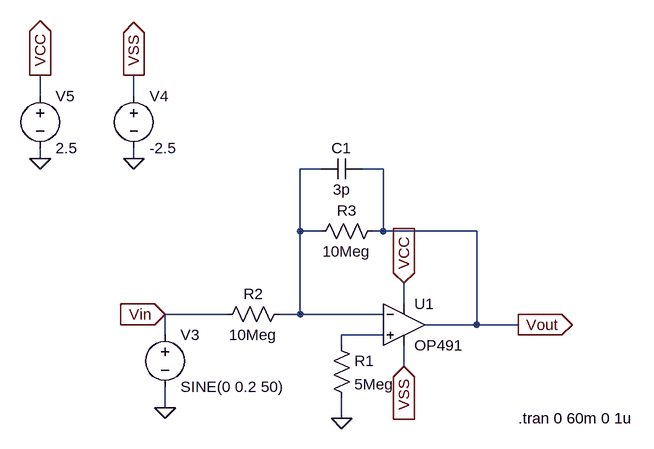
[diagram p0: schematic 007-Inverting-Amplifier-With-High-Input-Impedance.asc]
007-Inverting-Amplifier-With-High-Input-Impedance.asc, the LTspice schematic file:
Version 4
SHEET 1 880 680
WIRE -304 -176 -304 -208
WIRE -160 -176 -160 -208
WIRE -304 -80 -304 -96
WIRE -160 -80 -160 -96
WIRE 128 -64 96 -64
WIRE 224 -64 192 -64
WIRE 96 32 96 -64
WIRE 128 32 96 32
WIRE 224 32 224 -64
WIRE 224 32 208 32
WIRE 368 32 224 32
WIRE 256 144 256 112
WIRE -16 160 -112 160
WIRE 96 160 96 32
WIRE 96 160 64 160
WIRE 224 160 96 160
WIRE 368 176 368 32
WIRE 368 176 288 176
WIRE 432 176 368 176
WIRE -112 192 -112 160
WIRE 224 192 160 192
WIRE 160 208 160 192
WIRE 256 240 256 208
WIRE -112 304 -112 272
WIRE 160 320 160 288
FLAG 160 320 0
FLAG -112 304 0
FLAG -112 160 Vin
IOPIN -112 160 In
FLAG 432 176 Vout
IOPIN 432 176 Out
FLAG -160 -80 0
FLAG -304 -80 0
FLAG -304 -208 VCC
IOPIN -304 -208 Out
FLAG -160 -208 VSS
IOPIN -160 -208 Out
FLAG 256 112 VCC
IOPIN 256 112 In
FLAG 256 240 VSS
IOPIN 256 240 In
SYMBOL Opamps\\OP491 256 112 R0
SYMATTR InstName U1
SYMBOL res 144 192 R0
SYMATTR InstName R1
SYMATTR Value 5Meg
SYMBOL res 80 144 R90
WINDOW 0 0 56 VBottom 2
WINDOW 3 32 56 VTop 2
SYMATTR InstName R2
SYMATTR Value 10Meg
SYMBOL res 224 16 R90
WINDOW 0 0 56 VBottom 2
WINDOW 3 32 56 VTop 2
SYMATTR InstName R3
SYMATTR Value 10Meg
SYMBOL voltage -112 176 R0
WINDOW 123 0 0 Left 2
WINDOW 39 0 0 Left 2
SYMATTR InstName V3
SYMATTR Value SINE(0 0.2 50)
SYMBOL cap 192 -80 R90
WINDOW 0 0 32 VBottom 2
WINDOW 3 32 32 VTop 2
SYMATTR InstName C1
SYMATTR Value 3p
SYMBOL voltage -160 -192 R0
SYMATTR InstName V4
SYMATTR Value -2.5
SYMBOL voltage -304 -192 R0
SYMATTR InstName V5
SYMATTR Value 2.5
TEXT 432 320 Left 2 !.tran 0 60m 0 1u

The netlist it stands for:
* 007-Inverting-Amplifier-With-High-Input-Impedance.asc
XU1 N002 N001 VCC VSS Vout OP491  ; pins In+ In- V+ V- OUT
R1 N002 0 5Meg
R2 N001 Vin 10Meg
R3 Vout N001 10Meg
V3 Vin 0 SINE(0 0.2 50)
C1 Vout N001 3p
V4 VSS 0 -2.5
V5 VCC 0 2.5
.tran 0 60m 0 1u
.backanno
.end